# Altium schematic sheet Power Distribution - External ADC.SchDoc: External ADC
size B; Organization: Midnight Sun Solar Rayce Car Team; Address1: University of Waterloo; Address2: 200 University Ave W; Address3: Waterloo, ON, Canada; Address4: N2L 3E9; Website: www.uwmidsun.com; ProjectName: ProjectName
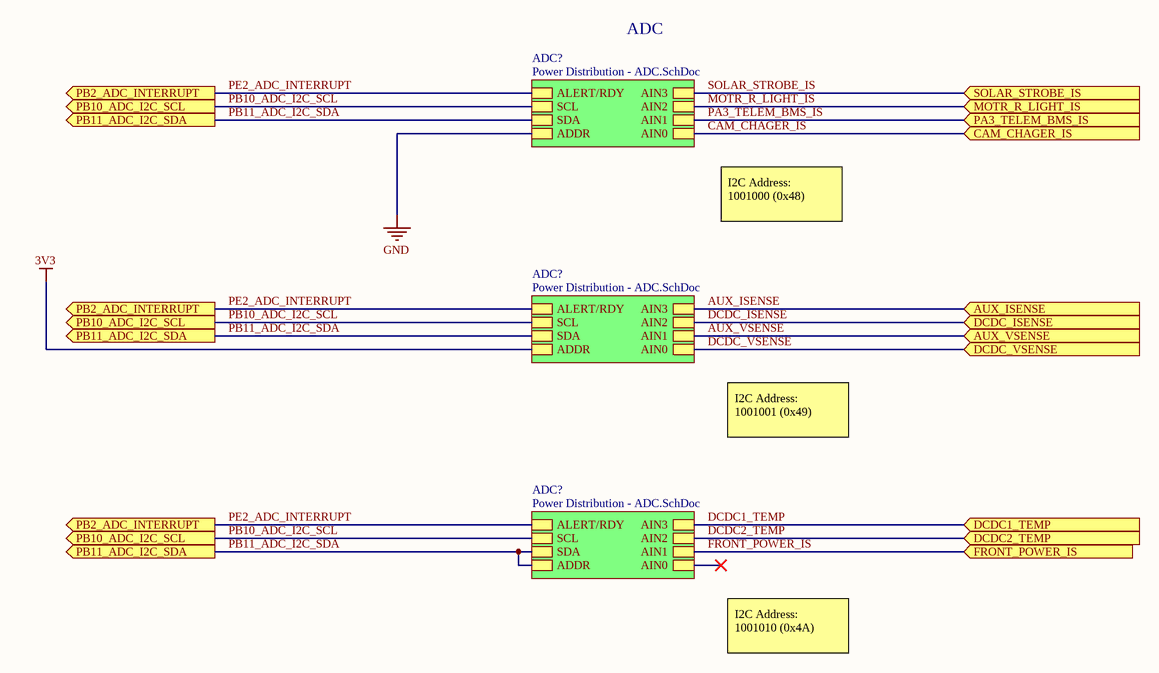
[diagram p0: Power Distribution - External ADC.SchDoc]

## Sub-sheets
ADC? = Power Distribution - ADC.SchDoc: ALERT/RDY, SCL, SDA, ADDR, AIN3, AIN2, AIN1, AIN0
ADC? = Power Distribution - ADC.SchDoc: ALERT/RDY, SCL, SDA, ADDR, AIN3, AIN2, AIN1, AIN0
ADC? = Power Distribution - ADC.SchDoc: ALERT/RDY, SCL, SDA, ADDR, AIN3, AIN2, AIN1, AIN0

## Ports
AUX_ISENSE (in), AUX_VSENSE (in), CAM_CHAGER_IS (in), DCDC1_TEMP (in), DCDC2_TEMP (in), DCDC_ISENSE (in), DCDC_VSENSE (in), FRONT_POWER_IS (in), MOTR_R_LIGHT_IS (in), PA3_TELEM_BMS_IS (in), PB2_ADC_INTERRUPT (out), PB10_ADC_I2C_SCL (out), PB11_ADC_I2C_SDA (out), SOLAR_STROBE_IS (in)

## Nets
3V3: sheet ADC?/ADDR
GND: sheet ADC?/ADDR
AUX_ISENSE: port AUX_ISENSE, sheet ADC?/AIN3
AUX_VSENSE: port AUX_VSENSE, sheet ADC?/AIN1
CAM_CHAGER_IS: port CAM_CHAGER_IS, sheet ADC?/AIN0
DCDC1_TEMP: port DCDC1_TEMP, sheet ADC?/AIN3
DCDC2_TEMP: port DCDC2_TEMP, sheet ADC?/AIN2
DCDC_ISENSE: port DCDC_ISENSE, sheet ADC?/AIN2
DCDC_VSENSE: port DCDC_VSENSE, sheet ADC?/AIN0
FRONT_POWER_IS: port FRONT_POWER_IS, sheet ADC?/AIN1
MOTR_R_LIGHT_IS: port MOTR_R_LIGHT_IS, sheet ADC?/AIN2
PA3_TELEM_BMS_IS: port PA3_TELEM_BMS_IS, sheet ADC?/AIN1
PB10_ADC_I2C_SCL: port PB10_ADC_I2C_SCL, sheet ADC?/SCL, sheet ADC?/SCL, sheet ADC?/SCL
PB11_ADC_I2C_SDA: port PB11_ADC_I2C_SDA, sheet ADC?/SDA, sheet ADC?/SDA, sheet ADC?/SDA, sheet ADC?/ADDR
PE2_ADC_INTERRUPT: port PB2_ADC_INTERRUPT, sheet ADC?/ALERT/RDY, sheet ADC?/ALERT/RDY, sheet ADC?/ALERT/RDY
SOLAR_STROBE_IS: port SOLAR_STROBE_IS, sheet ADC?/AIN3

## Notes on the sheet
- ADC
- I2C Address: 1001000 (0x48)
- I2C Address: 1001001 (0x49)
- I2C Address: 1001010 (0x4A)
- PROJECT
- DOCUMENT
- DRAWN BY
- LAST MODIFIED
- PART NUMBER
- REVISION
- SHEET
- VARIANT
- OF
- Engineering 5 - 1002
  University of Waterloo
  (519) 888-4567 x32978
  hardware@uwmidsun.com